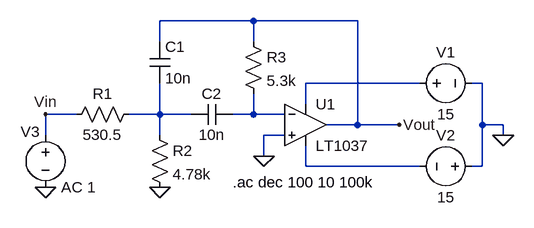
[diagram p0: schematic scheme4.asc]
scheme4.asc, the LTspice schematic file:
Version 4.1
SHEET 1 880 680
WIRE 80 32 -64 32
WIRE 240 32 80 32
WIRE -64 64 -64 32
WIRE 80 64 80 32
WIRE 336 128 160 128
WIRE 432 128 416 128
WIRE 160 160 160 128
WIRE -192 176 -240 176
WIRE -64 176 -64 128
WIRE -64 176 -112 176
WIRE -16 176 -64 176
WIRE 80 176 80 144
WIRE 80 176 48 176
WIRE 128 176 80 176
WIRE 240 192 240 32
WIRE 240 192 192 192
WIRE 304 192 240 192
WIRE 432 192 432 128
WIRE 464 192 432 192
WIRE -240 208 -240 176
WIRE -64 208 -64 176
WIRE 128 208 96 208
WIRE 464 208 464 192
WIRE 96 240 96 208
WIRE 160 256 160 224
WIRE 336 256 160 256
WIRE 432 256 432 192
WIRE 432 256 416 256
FLAG 464 208 0
FLAG 96 240 0
FLAG -64 288 0
FLAG -240 288 0
FLAG -240 176 Vin
FLAG 304 192 Vout
SYMBOL OpAmps\\LT1037 160 128 R0
SYMATTR InstName U1
SYMBOL voltage 320 128 R270
WINDOW 0 32 56 VTop 2
WINDOW 3 -32 56 VBottom 2
SYMATTR InstName V1
SYMATTR Value 15
SYMBOL voltage 432 256 R90
WINDOW 0 -32 56 VBottom 2
WINDOW 3 32 56 VTop 2
SYMATTR InstName V2
SYMATTR Value 15
SYMBOL cap -80 64 R0
SYMATTR InstName C1
SYMATTR Value 10n
SYMBOL cap 48 160 R90
WINDOW 0 0 32 VBottom 2
WINDOW 3 32 32 VTop 2
SYMATTR InstName C2
SYMATTR Value 10n
SYMBOL res -96 160 R90
WINDOW 0 0 56 VBottom 2
WINDOW 3 32 56 VTop 2
SYMATTR InstName R1
SYMATTR Value 530.5
SYMBOL res -80 192 R0
SYMATTR InstName R2
SYMATTR Value 4.78k
SYMBOL res 64 48 R0
SYMATTR InstName R3
SYMATTR Value 5.3k
SYMBOL voltage -240 192 R0
WINDOW 0 -38 11 Left 2
SYMATTR InstName V3
SYMATTR Value AC 1
TEXT 48 280 Left 2 !.ac dec 100 10 100k

The netlist it stands for:
* scheme4.asc
X§U1 0 N003 N001 N004 Vout LT1037  ; pins In+ In- V+ V- OUT
V1 N001 0 15
V2 0 N004 15
C1 Vout N002 10n
C2 N003 N002 10n
R1 N002 Vin 530.5
R2 N002 0 4.78k
R3 Vout N003 5.3k
V3 Vin 0 AC 1
.ac dec 100 10 100k
.backanno
.end